# EAGLE design main (EAGLE 9.1.1)
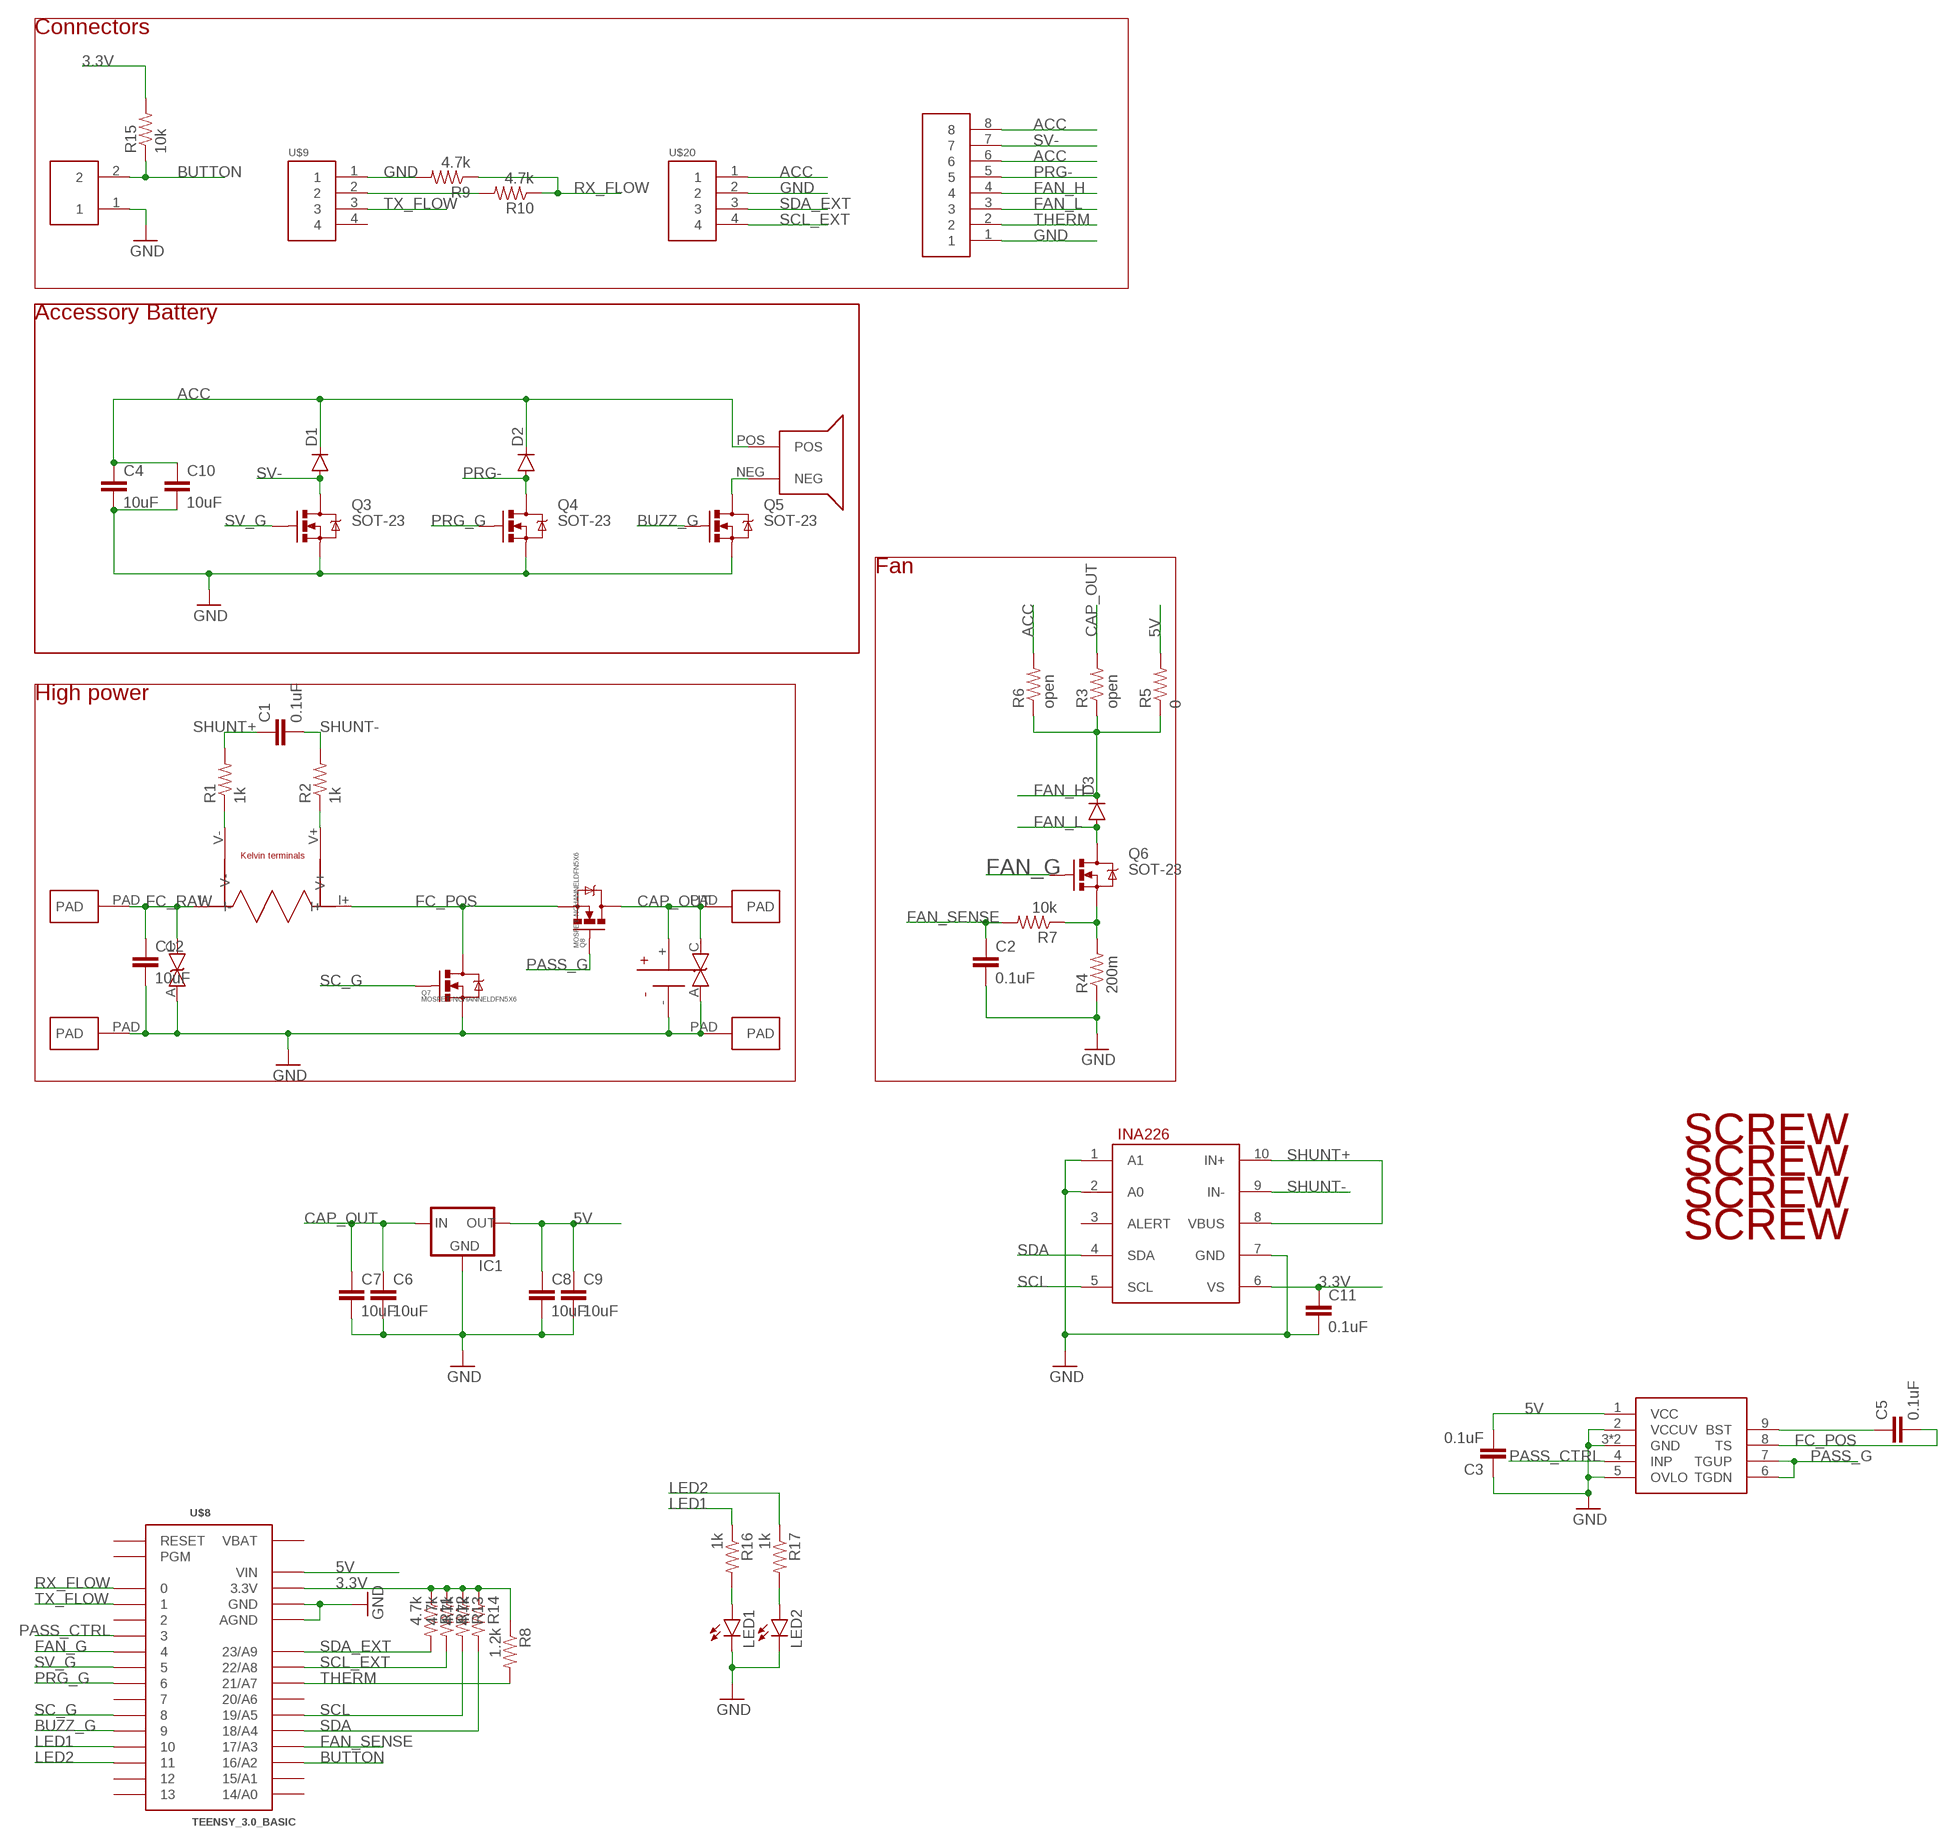
[diagram p0: schematic, sheet 1]

## Parts
C1  0.1uF  CAP0603-CAP  [0603-CAP]
C2  0.1uF  CAP0603-CAP  [0603-CAP]
C3  0.1uF  CAP0603-CAP  [0603-CAP]
C4  10uF  CAP1206  [1206]
C5  0.1uF  CAP0603-CAP  [0603-CAP]
C6  10uF  CAP1206  [1206]
C7  10uF  CAP1206  [1206]
C8  10uF  CAP1206  [1206]
C9  10uF  CAP1206  [1206]
C10  10uF  CAP1206  [1206]
C11  0.1uF  CAP0603-CAP  [0603-CAP]
C12  10uF  CAP1206  [1206]
D1  DIODESOD123  [SOD-123]
D2  DIODESOD123  [SOD-123]
D3  DIODESOD123  [SOD-123]
IC1  V_REG_78XXV78W  [V78W]
LED1  LED1206  [LED-1206]
LED2  LED1206  [LED-1206]
Q3  SOT-23  MOSFET-NCHANNELBSS123LT1G  [SOT23-3]
Q4  SOT-23  MOSFET-NCHANNELBSS123LT1G  [SOT23-3]
Q5  SOT-23  MOSFET-NCHANNELBSS123LT1G  [SOT23-3]
Q6  SOT-23  MOSFET-NCHANNELBSS123LT1G  [SOT23-3]
Q7  MOSFET-NCHANNELDFN5X6  [DFN5X6]
Q8  MOSFET-NCHANNELDFN5X6  [DFN5X6]
R1  1k  RESISTOR0603-RES  [0603-RES]
R2  1k  RESISTOR0603-RES  [0603-RES]
R3  open  RESISTOR0603-RES  [0603-RES]
R4  200m  RESISTOR0603-RES  [0603-RES]
R5  0  RESISTOR0603-RES  [0603-RES]
R6  open  RESISTOR0603-RES  [0603-RES]
R7  10k  RESISTOR0603-RES  [0603-RES]
R8  1.2k  RESISTOR0603-RES  [0603-RES]
R9  4.7k  RESISTOR0603-RES  [0603-RES]
R10  4.7k  RESISTOR0603-RES  [0603-RES]
R11  4.7k  RESISTOR0603-RES  [0603-RES]
R12  4.7k  RESISTOR0603-RES  [0603-RES]
R13  4.7k  RESISTOR0603-RES  [0603-RES]
R14  4.7k  RESISTOR0603-RES  [0603-RES]
R15  10k  RESISTOR0603-RES  [0603-RES]
R16  1k  RESISTOR0603-RES  [0603-RES]
R17  1k  RESISTOR0603-RES  [0603-RES]
U$1  SHUNT_KELVIN  [2512_KELVIN]
U$2  INA226  [PSOP-10]
U$3  PAD  [PAD]
U$4  PAD  [PAD]
U$5  HEADER8  [8PINVALULOK]
U$6  LTC7001  [PSOP-10-EP]
U$7  BUZZER12MM  [BUZZER_12MM]
U$8  TEENSY_3.0_BASIC  [TEENSY_3.0_BASIC]
U$9  HEADER4VALULOK  [4PINVALULOK]
U$10  PAD  [PAD]
U$11  PAD  [PAD]
U$12  CAP-AL_ELECTROLYTIC  [CAP-RADIAL]
U$13  HEADER2  [2PINVALULOK]
U$14  SCREW  [M3HOLE]
U$15  SCREW  [M3HOLE]
U$16  TVS_BIDO-214AB  [DO-214AB]
U$17  TVS_BIDO-214AB  [DO-214AB]
U$18  SCREW  [M3HOLE]
U$19  SCREW  [M3HOLE]
U$20  HEADER4VALULOK  [4PINVALULOK]

## Nets
3.3V: C11.1 R8.1 R11.1 R12.1 R13.1 R14.1 R15.2 U$2.6(VS) U$8.3.3V U$8.3.3V1(3.3V)
5V: C3.2 C8.1 C9.1 IC1.OUT R5.2 U$6.1(VCC) U$8.VIN
ACC: C4.1 C10.1 D1.C D2.C R6.2 U$5.6 U$5.8 U$7.POS U$20.1
BUTTON: R15.1 U$8.16/A2 U$13.2
BUZZ_G: Q5.1(G) U$8.9
CAP_OUT: C6.1 C7.1 IC1.IN Q8.PAD(D) R3.2 U$10.PAD U$12.+(V+) U$17.C
FAN_G: Q6.1(G) U$8.4
FAN_H: D3.C R3.1 R5.1 R6.1 U$5.4
FAN_L: D3.A Q6.3(D) U$5.3
FAN_SENSE: C2.1 R7.2 U$8.17/A3
FC_POS: C5.2 Q7.PAD(D) Q8.1(S) Q8.2(S) Q8.3(S) U$1.I+ U$6.8(TS)
FC_RAW: C12.1 U$1.I- U$3.PAD U$16.C
GND: C2.2 C3.1 C4.2 C6.2 C7.2 C8.2 C9.2 C10.2 C11.2 C12.2 IC1.GND LED1.C LED2.C Q3.2(S) Q4.2(S) Q5.2(S) Q7.1(S) Q7.2(S) Q7.3(S) R4.1 R9.2 U$2.1(A1) U$2.2(A0) U$2.7(GND) U$4.PAD U$5.1 U$6.2(VCCUV) U$6.3(GND) U$6.5(OVLO) U$6.PAD(GND) U$8.AGND U$8.GND U$8.GND1(GND) U$9.1 U$11.PAD U$12.-(V-) U$13.1 U$16.A U$17.A U$20.2
LED1: R16.1 U$8.10
LED2: R17.1 U$8.11
N$1: C5.1 U$6.9(BST)
N$2: LED1.A R16.2
N$3: Q5.3(D) U$7.NEG
N$7: R1.1 U$1.V-
N$8: R2.1 U$1.V+
N$9: Q6.2(S) R4.2 R7.1
N$10: R10.2 U$9.2
N$11: LED2.A R17.2
PASS_CTRL: U$6.4(INP) U$8.3
PASS_G: Q8.4(G) U$6.6(TGDN) U$6.7(TGUP)
PRG-: D2.A Q4.3(D) U$5.5
PRG_G: Q4.1(G) U$8.6
RX_FLOW: R9.1 R10.1 U$8.0
SC_G: Q7.4(G) U$8.8
SCL: R13.2 U$2.5(SCL) U$8.19/A5
SCL_EXT: R12.2 U$8.22/A8 U$20.4
SDA: R14.2 U$2.4(SDA) U$8.18/A4
SDA_EXT: R11.2 U$8.23/A9 U$20.3
SHUNT+: C1.1 R1.2 U$2.8(VBUS) U$2.10(IN+)
SHUNT-: C1.2 R2.2 U$2.9(IN-)
SV-: D1.A Q3.3(D) U$5.7
SV_G: Q3.1(G) U$8.5
THERM: R8.2 U$5.2 U$8.21/A7
TX_FLOW: U$8.1 U$9.3
Unconnected: U$2.3(ALERT) U$8.2 U$8.7 U$8.12 U$8.13 U$8.14/A0 U$8.15/A1 U$8.20/A6 U$8.PGM U$8.RESET U$9.4

## Notes on the sheet
- Connectors
- Accessory Battery
- Fan
- High power

## Power pins joined to a net without a drawn wire
VBAT: U$8.VBAT

## Library data of the parts
C1-C12 = SparkFun-Passives:CAP: Capacitor Standard 0603 ceramic capacitor, and 0.1" leaded capacitor.
D1-D3 = SparkFun-DiscreteSemi:DIODE: Diode These are standard reverse protection diodes and small signal diodes. SMA package can handle up to about 1A. SOD-323 can handle about 200mA. What the SOD-323 package when ordering, there are some mfgs out there that are 5-pin packages.
IC1 = 2018:V_REG_78XX: Voltage Regulator Standard 7805 5V regulator. IGO (Input Ground Output). Spark Fun Electronics SKU : COM-00107
LED1 LED2 = SparkFun-LED:LED: LEDs Standard schematic elements and footprints for 5mm, 3mm, 1206, and 0603 sized LEDs. 5mm - Spark Fun Electronics SKU : COM-00529 (and others)
Q3-Q6 = SparkFun-DiscreteSemi:MOSFET-NCHANNEL: Common NMOSFET Parts MFG P/N Store ID Prod ID FDD8780 TRANS-09984 SI7820DN TRANS-11055 FDS6630A IC-08089 2N7002PW TRANS-11151 FQP30N06L COM-10213 TRANS-10060 BSS123LT1G TRANS-08345 BSS138 TRANS-00830 BS170 2N7000; PROD_ID: TRANS-08345
Q7 Q8 = 2018:MOSFET-NCHANNEL: Generic NMOS footprint
R1-R17 = SparkFun-Passives:RESISTOR: Resistor Basic schematic elements and footprints for 0603, 1206, and PTH resistors.
U$1 = 2018:SHUNT_KELVIN
U$2 = Custom_old (1):INA226
U$3 U$4 U$10 U$11 = Custom_old (1):PAD
U$5 = Custom_old:HEADER8
U$6 = 2018:LTC7001
U$7 = 2018:BUZZER
U$8 = Teensy3.0:TEENSY_3.0_BASIC: Basic Teensy 3.0 with none of the 'inner' pins enabled. See '+4', 'AllAnalogPins", and 'AllPins' packages for additional pin holes, as needed.
U$9 U$20 = Custom_old:HEADER4
U$12 = 2018:CAP-AL_ELECTROLYTIC
U$13 = Custom_old:HEADER2
U$14 U$15 U$18 U$19 = Custom_old:SCREW
U$16 U$17 = 2018:TVS_BI

## Board
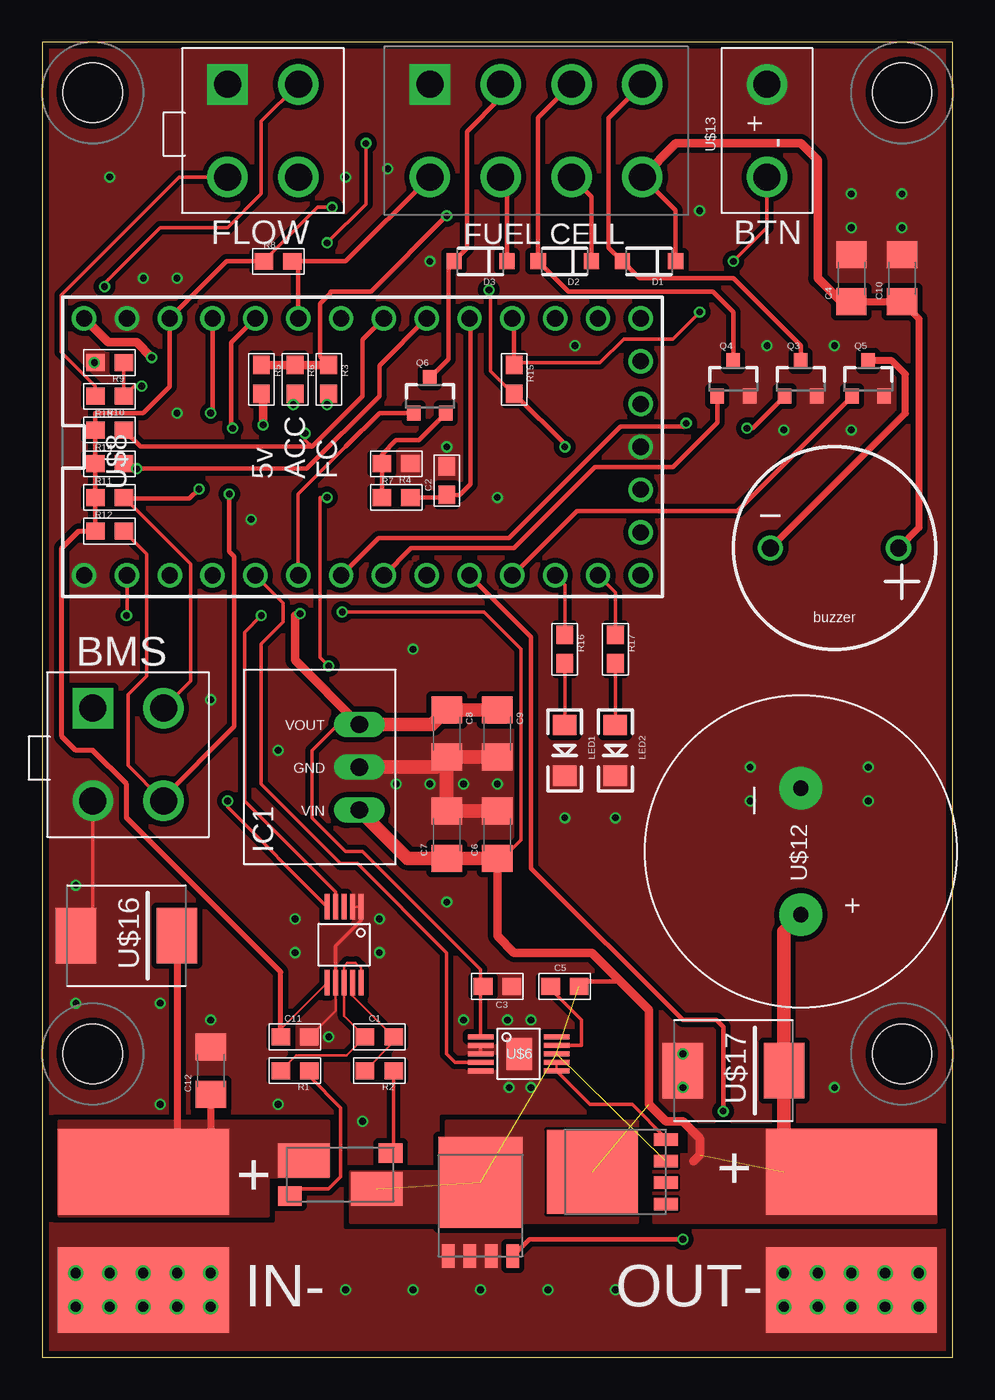
[diagram p1: board, top side]
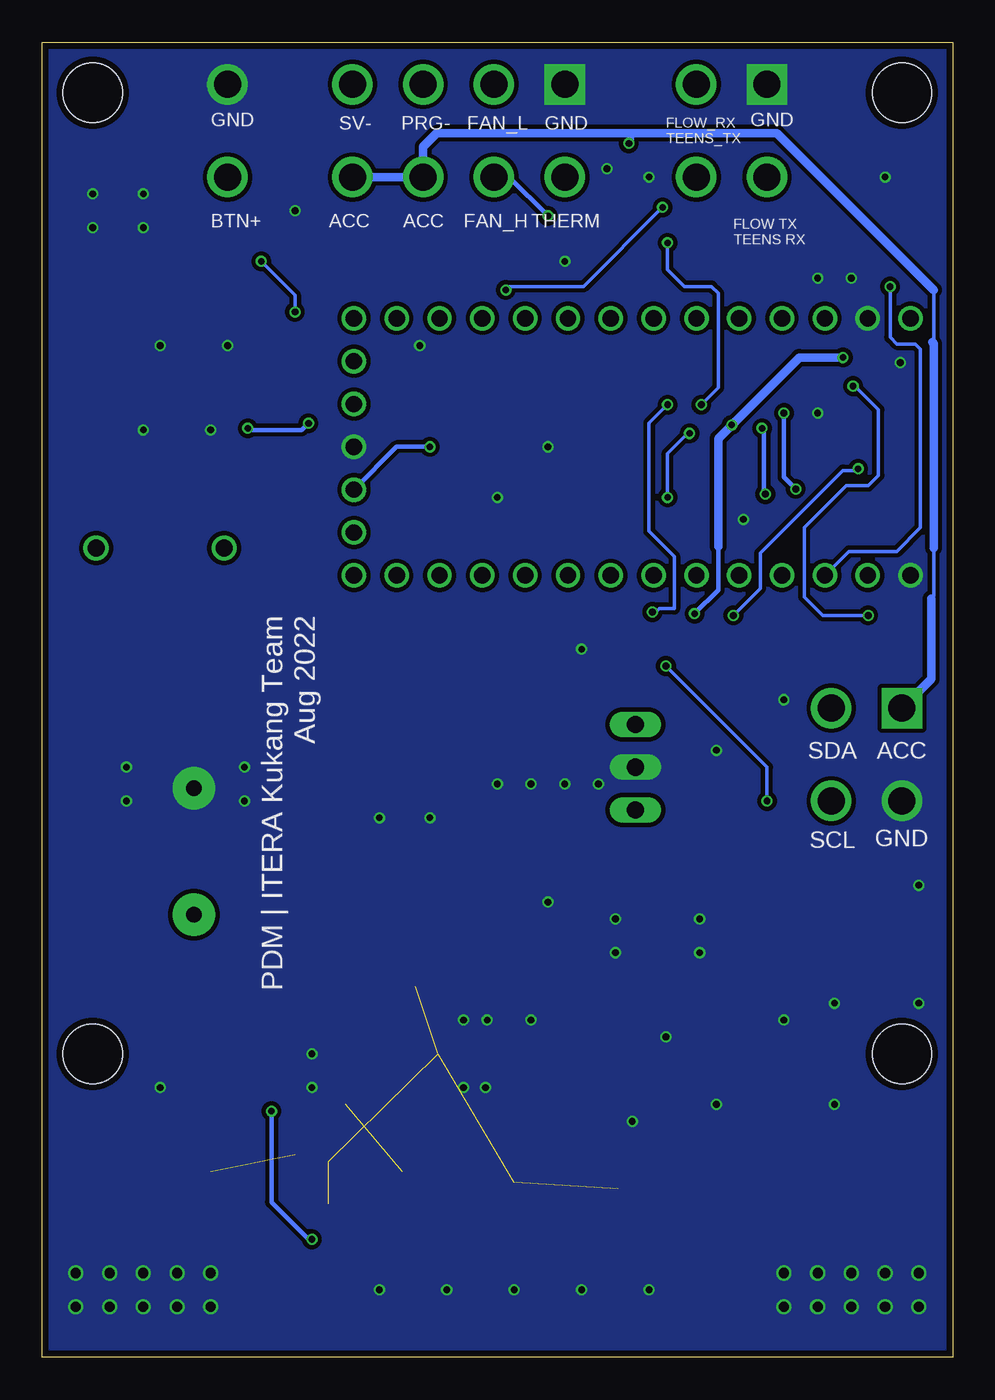
[diagram p2: board, bottom side, seen from below]

Size 54 x 78 mm. Coordinates in mm from the lower left corner, seen from the top.
Outline: 0,0 54,0 54,78 0,78 0,0
Copper layers (1*16): Top 0.035559375mm / dielectric 1.6mm / Bottom 0.035559375mm
Design rules "PATRICK-2lyr *": minimum track width 6mil, minimum drill 10mil, track to track 6mil, track to pad 6mil, pad to pad 6mil, via to via 6mil, smd to smd 6mil, copper to edge 15mil, drill to drill 6mil, minimum pad ring 5mil, minimum via ring 5mil, stop-mask expansion 2.5mil, vias tented up to drill 25mil, thermal gap 10mil

### Footprints (pad centres in the part's own frame; a part is rotated, then mirrored left to right if it is on the bottom)
0603-CAP = smd 1.1 x 1: 1 -0.85,0; 2 0.85,0
1206 = smd 1.6 x 1.8: 1 -1.4,0; 2 1.4,0
SOD-123 = smd 0.9 x 0.95: A 1.575,0; C -1.575,0
V78W = drill 1.016 long: GND 0,-3.81; IN -2.54,-3.81; OUT 2.54,-3.81
LED-1206 = smd 1.2 x 1.4: A -1.5,0; C 1.5,0
SOT23-3 = smd 0.8 x 0.9: 1 -0.95,-1; 2 0.95,-1; 3 0,1.1
DFN5X6 = smd 0.75 x 1.4: 1 -1.905,-3; 2 -0.635,-3; 3 0.635,-3; 4 1.905,-3 | smd 5 x 5.4: PAD 0,1.37
0603-RES = smd 1.1 x 1: 1 -0.85,0; 2 0.85,0
2512_KELVIN = smd 3.048 x 2.007: I+ 5.842,1.003; I- 1.524,2.68 | smd 1.397 x 1.143: V+ 6.668,3.111; V- 0.699,0.572
PSOP-10 = smd 1.5 x 0.3: 1 0,1; 2 0,0.5; 3 0,0; 4 0,-0.5; 5 0,-1; 6 4.5,-1; 7 4.5,-0.5; 8 4.5,0; 9 4.5,0.5; 10 4.5,1
PAD = smd 10.16 x 5.08: PAD 0,0
8PINVALULOK = drill 1.6 square: 1 0,5.5 | drill 1.6: 2 0,0; 3 4.2,5.5; 4 4.2,0; 5 8.4,5.5; 6 8.4,0; 7 12.6,5.5; 8 12.6,0
PSOP-10-EP = smd 1.5 x 0.3: 1 -2.286,1; 2 -2.286,0.5; 3 -2.286,0; 4 -2.286,-0.5; 5 -2.286,-1; 6 2.214,-1; 7 2.214,-0.5; 8 2.214,0; 9 2.214,0.5; 10 2.214,1 | smd 1.524 x 1.88: PAD 0,0
BUZZER_12MM = drill 1: NEG 0,-3.8; POS 0,3.8
TEENSY_3.0_BASIC = drill 0.965: 0 -7.62,13.97; 1 -7.62,11.43; 2 -7.62,8.89; 3 -7.62,6.35; 3.3V 7.62,11.43; 3.3V1 -2.54,-16.51; 4 -7.62,3.81; 5 -7.62,1.27; 6 -7.62,-1.27; 7 -7.62,-3.81; 8 -7.62,-6.35; 9 -7.62,-8.89; 10 -7.62,-11.43; 11 -7.62,-13.97; 12 -7.62,-16.51; 13 7.62,-16.51; 14/A0 7.62,-13.97; 15/A1 7.62,-11.43; 16/A2 7.62,-8.89; 17/A3 7.62,-6.35; 18/A4 7.62,-3.81; 19/A5 7.62,-1.27; 20/A6 7.62,1.27; 21/A7 7.62,3.81; 22/A8 7.62,6.35; 23/A9 7.62,8.89; AGND 7.62,13.97; GND -7.62,16.51; GND1 0,-16.51; PGM 2.54,-16.51; RESET 5.08,-16.51; VBAT -5.08,-16.51; VIN 7.62,16.51
4PINVALULOK = drill 1.6 square: 1 0,5.5 | drill 1.6: 2 0,0; 3 4.2,5.5; 4 4.2,0
CAP-RADIAL = drill 0.9 pad 2.54: + 0,-3.75; - 0,3.75
2PINVALULOK = drill 1.6: 1 0,5.5; 2 0,0
M3HOLE = hole 3.5: 0,0
DO-214AB = smd 2.4 x 3.3: A 3,0; C -3,0

### Placement (x,y rotation side)
C1  20,19 0 top
C2  24,52 90 top
C3  27,22 180 top
C4  48,64 90 top
C5  31,22 0 top
C6  27,31 90 top
C7  24,31 90 top
C8  24,37 270 top
C9  27,37 270 top
C10  51,64 90 top
C11  15,19 0 top
C12  10,17 90 top
D1  36,65 180 top
D2  31,65 180 top
D3  26,65 180 top
IC1  15,35 90 top
LED1  31,36 270 top
LED2  34,36 270 top
Q3  45,58 0 top
Q4  41,58 0 top
Q5  49,58 0 top
Q6  23,57 0 top
Q7  26,9 0 top
Q8  34,11 90 top
R1  15,17 180 top
R2  20,17 180 top
R3  17,58 270 top
R4  21,53 180 top
R5  13,58 270 top
R6  15,58 270 top
R7  21,51 0 top
R8  14,65 0 top
R9  4,59 180 top
R10  4,57 180 top
R11  4,51 0 top
R12  4,49 0 top
R13  4,55 0 top
R14  4,53 0 top
R15  28,58 270 top
R16  31,42 270 top
R17  34,42 270 top
U$1  14,9 0 top
U$2  17.91,26.72 270 top
U$3  6,11 0 top
U$4  6,4 0 top
U$5  23,70 0 top
U$6  28.3,18 0 top
U$7  47,48 270 top
U$8  19,54 90 top
U$9  11,70 0 top
U$10  48,11 0 top
U$11  48,4 0 top
U$12  45,30 0 top
U$13  43,70 0 top
U$14  51,75 0 top
U$15  3,75 0 top
U$16  5,25 180 top
U$17  41,17 180 top
U$18  51,18 0 top
U$19  3,18 0 top
U$20  3,33 0 top

### Tracks (layer width: path | path; a pad name or v marks a point on that pad's centre or on a via)
3.3V  (via drill 0.4)
  Top 0.152: C11.1 14.15,19.46 U$2.6
  Top 0.203: R8.1 16.35,68.2 v17.2,68.2 | v26.5,63.3 26.6,63.2 26.6,58.5 28.02,57.08 28.07,57.08
  Top 0.254: R12.1 R11.1 R14.1 R13.1 3.15,56 6,56 7.57,57.57 U$8.3.3V 10.95,65 R8.1 | R15.2 28.07,57.08 31,54.15 v31,54
  Top 0.305: C11.1 14.15,22.85 5,32 5,34 3,36 2,36 1.17,36.83 1.17,48 2.17,49 R12.1
  Bottom 0.203: v17.2,68.2 21.9,63.5 26.6,63.5 26.6,63.4 v26.5,63.3
  Bottom 0.254: v31,54 32.97,54 U$8.3.3V1
5V  (via drill 0.4)
  Top 0.203: U$6.1 26,22 26,23 19,30 18,30 16,32 16,36 17.54,37.54 IC1.OUT
  Top 0.254: C3.2 26,22
  Top 0.508: IC1.OUT 15,41.35 15,44 15.2,44 v15.3,44.1 | v13.1,55.3 13.1,57.05 R5.2 | v6.5,59.3 5.6,60.2 3.91,60.2 U$8.VIN
  Top 0.813: IC1.OUT 23.14,37.54 C8.1 C9.1
  Bottom 0.254: v15.3,44.1 13.9,45.5 13.9,48.1
  Bottom 0.508: 13.9,48.1 13.9,54.5 v13.1,55.3 9.1,59.3 v6.5,59.3
ACC  (via drill 0.4)
  Top 0.203: R6.2 15,56.4 14.9,56.3 v14.9,56.5 | v16.9,66.1 19.2,68.4 v19.2,72
  Top 0.254: D1.C 37.58,68.03 U$5.8 | D2.C 32.58,68.83 U$5.6
  Top 0.406: C4.1 C10.1 52,61.6 52,49.2 U$7.POS
  Top 0.508: U$5.8 37.6,72 45,72 46,71 46,64 47.4,62.6 C4.1
  Bottom 0.203: 1.27,45 1.12,45.15 1.12,48 | 1.2,60.2 1.12,60.28 1.12,63.3 | v14.9,56.5 13.9,57.5 13.9,63.1 14.3,63.5 15.9,63.5 16.9,64.5 v16.9,66.1 | v19.2,72 19,72.2 19,72.6
  Bottom 0.508: U$20.1 1.27,40.23 1.27,45 | 1.12,48 1.12,60.12 1.2,60.2 | 1.12,63.3 10.42,72.6 19,72.6 30.6,72.6 31.4,71.8 U$5.6 U$5.8
BUTTON  (via drill 0.4)
  Top 0.203: U$13.2 43,67 v41,65 | v39,62 37.4,60.4 34.5,60.4 33.1,59 28,59
  Top 0.254: R15.1 28,59 28,61.51 U$8.16/A2
  Bottom 0.203: v41,65 39,63 v39,62
BUZZ_G
  Top 0.254: U$8.9 31.71,50.2 41.25,50.2 Q5.1
CAP_OUT  (via drill 0.4)  (2 unrouted)
  Top 0.203: R3.2 16.9,57.05 v16.9,56.5 | v17.8,44.2 26.2,44.2 28.4,42 28.4,30.7 27.3,29.6 27.3,29.3
  Top 0.254: 32.15,22.3 34.3,22.3
  Top 0.508: 27.3,29.3 C6.1 27,25 28,24 32.6,24 34.3,22.3 36,20.6 36,18 36,15 37,14 38,14 39,13 39,12 38.63,11.63
  Top 0.813: U$10.PAD 44,11 U$17.C 44,25.25 U$12.+ | IC1.IN 21.67,29.6 C7.1 C6.1
  Bottom 0.203: v16.9,56.5 18,55.4 18,49 16.5,47.5 16.5,44.4 17.4,44.4 17.6,44.2 v17.8,44.2
  pour Top (no thermals): 36.3,12 36.3,8 53,8 53,13.5 38.4,13.5 38.4,12
FAN_G
  Top 0.203: U$8.4 15.19,51.19 18,54
  Top 0.254: 18,54 20,56 Q6.1
FAN_H  (via drill 0.4)
  Top 0.254: D3.C 27.57,69.62 U$5.4 | R3.1 16.5,59.35 16.5,62.5 17.1,63.1 17.1,63.2 19.5,63.2 v24,67.7 24.1,67.8
  Top 0.508: R5.1 R6.1 R3.1
  Bottom 0.254: v24,67.7 26.3,70 U$5.4
FAN_L
  Top 0.254: U$5.3 27.2,74.7 25.2,72.7 25.2,65.78 D3.A 24.1,64.67 24.1,59.2 Q6.3
FAN_SENSE
  Top 0.254: R7.2 23.85,51 C2.1 24.75,51.15 25.4,51.8 25.4,61.57 U$8.17/A3
FC_POS  (6 unrouted)
  pour Top (no thermals): 18.3,11 18.3,8 35.3,8 35.3,14 24,14 24,11
FC_RAW
  Top 0.406: U$16.C 8,13 | 8,13 arc-90 U$3.PAD | C12.1 10,13 8,13
  pour Top (no thermals): 1,14 17,14 17,10.7 13.4,10.7 13.4,8.4 1,8.4
GND  (via drill 0.4, 0.6)
  Top 0.152: C11.2 17.41,20.56 U$2.7 | U$2.2 U$2.1
  Top 0.203: U$16.A 3,26 U$20.2 | U$6.3 U$6.2 | U$2.7 17.41,24.41 18.91,25.91 U$2.1
  Top 0.813: IC1.GND 23.4,35 C8.2 | C8.2 C9.2 | C6.2 C7.2 C8.2
  other vias: 44,5 44,3 46,3 46,5 48,5 48,3 50,3 50,5 52,5 52,3 2,5 2,3 4,3 4,5 6,5 6,3 8,3 8,5 10,5 10,3 10,20 17,19 24,54 3.1,59 38,18 38,16 18,4 22,4 26,4 30,4 34,4 2,28 2,21 7,21 7,15 14,15 19,14 27.6,20 29,20 27.7,16 29,16 25,20 42,35 42,33 49,33 49,35 31,32 34,32 27,34 25,34 23,34 21,34 24,27 20,26 20,24 15,26 15,24 22,42 14,36 44,55 48,55 47,60 43,60 48,67 51,67 51,69 48,69 39,68 20.5,70.5 18,70 4,70 8,64 6,64 47,16 12.4,49.7 31.6,60 23,65 8,56 10,39 27,51
  pour Top (isolate 0.305, rank 6, no thermals): 0,78 0,0 54,0 54,78
  pour Bottom (isolate 0.254, no thermals): 0,78 -1,0 54,0 54,78
LED1
  Top 0.203: R16.1 31,45.81 U$8.10
LED2
  Top 0.203: R17.1 34,45.35 U$8.11
N$1
  Top 0.203: U$6.9 32,18.5 32,20 30.15,21.85 C5.1
N$2
  Top 0.203: LED1.A R16.2
N$3
  Top 0.406: U$7.NEG 51.2,56 51.2,58.3 50.4,59.1 Q5.3
N$7
  Top 0.203: U$1.V- 15.13,10 17,10 17.7,10.7 17.7,14.8 15.85,16.65 R1.1
N$8
  Top 0.203: U$1.V+ 20.85,12.29 R2.1
N$9
  Top 0.254: R7.1 R4.2 20.15,53.55 21,54.4 22.35,54.4 Q6.2
N$10
  Top 0.203: R10.2 3.15,57.59 1.12,59.62 1.12,63 8.12,70 U$9.2
N$11
  Top 0.203: R17.2 LED2.A
PASS_CTRL
  Top 0.203: U$6.4 24.5,17.5 24,18 24,24 18.7,29.3 17.7,29.3 13,34 13,42.3 14.3,43.6 14.3,44.73 U$8.3
PASS_G
  Top 0.152: U$6.7 U$6.6
  Top 0.203: U$6.6 32.5,15 35,15 37,13 Q8.4
PRG-
  Top 0.254: U$5.5 29.43,73.53 D2.A 31.23,63.2 39.8,63.2 41,62 Q4.3
PRG_G
  Top 0.254: U$8.6 21.89,48 28,48 32.8,52.8 37.4,52.8 40.05,55.45 Q4.1
RX_FLOW  (via drill 0.4)
  Top 0.203: R9.1 R10.1 5.45,57.6 v5.9,57.6 | U$8.0 5.03,44.03 v5,44
  Bottom 0.203: v5,44 7.7,44 8.8,45.1 8.8,49.2 6.3,51.7 5,51.7 4.4,52.3 4.4,56.2 5.8,57.6 v5.9,57.6
SC_G  (via drill 0.4)
  Top 0.254: U$8.8 29,42.73 29,29 38,20 40,20 40.4,19.6 v40.4,14.6 | v38,7 28.91,7 Q7.4
  Bottom 0.254: v40.4,14.6 40.4,9.2 38,6.8 v38,7
SCL  (via drill 0.4)
  Top 0.203: U$2.5 11,32.63 v11,33 | v17,41 16.5,41.5 16.5,51 v16.9,51 | v15.6,54.8 15.6,54.4 16,54
  Top 0.254: U$8.19/A5 19,60.35 19,57 16,54 5.85,54 R13.2
  Bottom 0.203: v11,33 11,35 v17,41 | v16.9,51 16.9,53.6 15.7,54.8 v15.6,54.8
SCL_EXT  (via drill 0.4)
  Top 0.203: R12.2 6.2,47.65 6.2,40.4 5.1,39.3 5.1,35.1 7.1,33.1 U$20.4
  Top 0.254: U$8.22/A8 11.2,60.17 11.2,55.2 v11.3,55.1 | v11.1,51.2 11.1,47.8 11.4,47.5 11.4,37.4 7.1,33.1
  Bottom 0.254: v11.3,55.1 11.2,55 11.2,51.3 v11.1,51.2
SDA  (via drill 0.4)
  Top 0.203: U$2.4 17.41,27.59 12,33 12,43 v13,44 | v5.6,52.7 5.3,53 R14.2
  Top 0.254: U$8.18/A4 20,58.81 20,57 15.7,52.7 v5.6,52.7
  Bottom 0.203: v13,44 11.4,45.6 11.4,47.7 6.5,52.6 5.7,52.6 v5.6,52.7
SDA_EXT  (via drill 0.4)
  Top 0.203: R11.2 4.92,50.92 8.8,47.05 8.8,40.1 U$20.3
  Top 0.254: U$8.23/A9 10.11,56.11 v10,56 | v9.3,51.5 8.72,50.92 4.92,50.92
  Bottom 0.254: v10,56 10,52.2 v9.3,51.5
SHUNT+
  Top 0.152: R1.2 15.05,17.9 18.05,17.9 C1.1 17.91,20.24 U$2.8 17.91,23.21 18.1,23.4 18.6,23.4 18.91,23.09 U$2.10
SHUNT-
  Top 0.152: R2.2 20.85,18.7 C1.2 18.41,21.44 U$2.9
SV-
  Top 0.254: U$5.7 33.6,73.5 33.6,65.83 D1.A 35.42,64 41,64 45,60 Q3.3
SV_G  (via drill 0.4)
  Top 0.254: U$8.5 19.95,48.6 27.7,48.6 34.3,55.2 38.2,55.2 v38.2,55.4 | v41.8,55.1 42.15,55.1 Q3.1
  Bottom 0.254: v38.2,55.4 38.6,55 41.7,55 v41.8,55.1
THERM
  Top 0.254: U$5.2 18,65 R8.2 15.19,64.66 U$8.21/A7
TX_FLOW  (via drill 0.4)
  Top 0.203: U$9.3 13,73.3 13,69 11,67 7,67 3.8,63.8 3.8,63.6 v3.7,63.5
  Bottom 0.203: v3.7,63.5 3.7,60.5 3.3,60.1 2.2,60.1 1.9,59.8 1.9,49.2 3.3,47.8 6.15,47.8 U$8.1

### Text on the board
tPlace: FLOW | FUEL CELL | BTN | 5v / ACC / FC | BMS | + | + | IN- | OUT-
bPlace: GND | GND | FAN_L | PRG- | SV- | GND | FLOW_RX / TEENS_TX | THERM | FAN_H | ACC | ACC | BTN+ | FLOW TX / TEENS RX | PDM | ITERA Kukang Team / Aug 2022 | ACC | SDA | GND | SCL